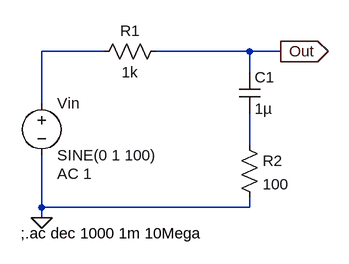
[diagram p0: schematic Q1_a.asc]
Q1_a.asc, the LTspice schematic file:
Version 4
SHEET 1 880 680
WIRE 112 32 16 32
WIRE 336 32 192 32
WIRE 384 32 336 32
WIRE 336 64 336 32
WIRE 16 112 16 32
WIRE 336 176 336 128
WIRE 16 272 16 192
WIRE 336 272 336 256
WIRE 336 272 16 272
WIRE 16 288 16 272
FLAG 16 288 0
FLAG 384 32 Out
IOPIN 384 32 Out
SYMBOL voltage 16 96 R0
WINDOW 123 24 124 Left 2
WINDOW 39 0 0 Left 0
SYMATTR Value2 AC 1
SYMATTR InstName Vin
SYMATTR Value SINE(0 1 100)
SYMBOL res 208 16 R90
WINDOW 0 0 56 VBottom 2
WINDOW 3 32 56 VTop 2
SYMATTR InstName R1
SYMATTR Value 1k
SYMBOL cap 320 64 R0
SYMATTR InstName C1
SYMATTR Value 1µ
SYMBOL res 320 160 R0
SYMATTR InstName R2
SYMATTR Value 100
TEXT -16 312 Left 2 !;.ac dec 1000 1m 10Mega

The netlist it stands for:
* Q1_a.asc
Vin N001 0 SINE(0 1 100) AC 1
R1 Out N001 1k
C1 Out N002 1µ
R2 N002 0 100
;.ac dec 1000 1m 10Mega
.backanno
.end